# EAGLE design preamp (EAGLE 9.2.1)
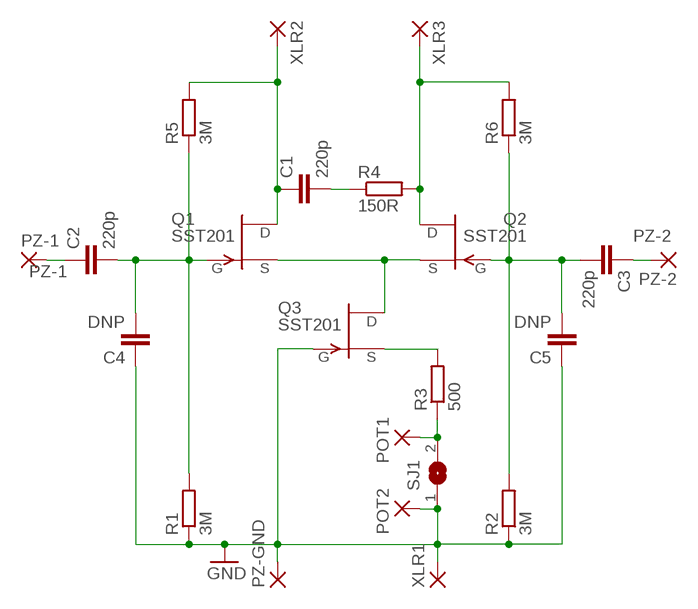
[diagram p0: schematic, sheet 1]

## Parts
C1  220p  C-EUC1206  [C1206]
C2  220p  C-EUC1206  [C1206]
C3  220p  C-EUC1206  [C1206]
C4  DNP  C-EUC1206  [C1206]
C5  DNP  C-EUC1206  [C1206]
POT1  3,17/1,3  [3,17/1,3]
POT2  3,17/1,3  [3,17/1,3]
PZ-1  3,17/1,3  [3,17/1,3]
PZ-2  3,17/1,3  [3,17/1,3]
PZ-GND  3,17/1,3  [3,17/1,3]
Q1  SST201  [SOT23]
Q2  SST201  [SOT23]
Q3  SST201  [SOT23]
R1  3M  R-EU_R1206  [R1206]
R2  3M  R-EU_R1206  [R1206]
R3  500  R-EU_R1206  [R1206]
R4  150R  R-EU_R1206  [R1206]
R5  3M  R-EU_R1206  [R1206]
R6  3M  R-EU_R1206  [R1206]
SJ1  SJ  [SJ]
XLR1  3,17/1,3  [3,17/1,3]
XLR2  3,17/1,3  [3,17/1,3]
XLR3  3,17/1,3  [3,17/1,3]

## Nets
GND: C4.1 C5.1 POT2.1(P) PZ-GND.1(P) Q3.3(G) R1.1 R2.1 SJ1.1 XLR1.1(P)
N$1: Q1.2(S) Q2.2(S) Q3.1(D)
N$2: POT1.1(P) R3.1 SJ1.2
N$3: C2.2 C4.2 Q1.3(G) R1.2 R5.1
N$5: C1.2 R4.1
N$7: C3.2 C5.2 Q2.3(G) R2.2 R6.1
N$9: Q3.2(S) R3.2
PZ-1: C2.1 PZ-1.1(P)
PZ-2: C3.1 PZ-2.1(P)
XLR3: Q2.1(D) R4.2 R6.2 XLR3.1(P)
XLR-2: C1.1 Q1.1(D) R5.2 XLR2.1(P)

## Library data of the parts
C1-C5 = rcl:C-EU: CAPACITOR, European symbol
POT1 POT2 PZ-1 PZ-2 PZ-GND XLR1-XLR3 = wirepad:3,17/1,3: THROUGH-HOLE PAD
Q1-Q3 = transistor-fet:?20*: TEMIC / Siliconix N-Channel JFET Source: JFET-J201_Siliconix_data.pdf
R1-R6 = rcl:R-EU_: RESISTOR, European symbol
SJ1 = jumper:SJ: SMD solder JUMPER

## Board
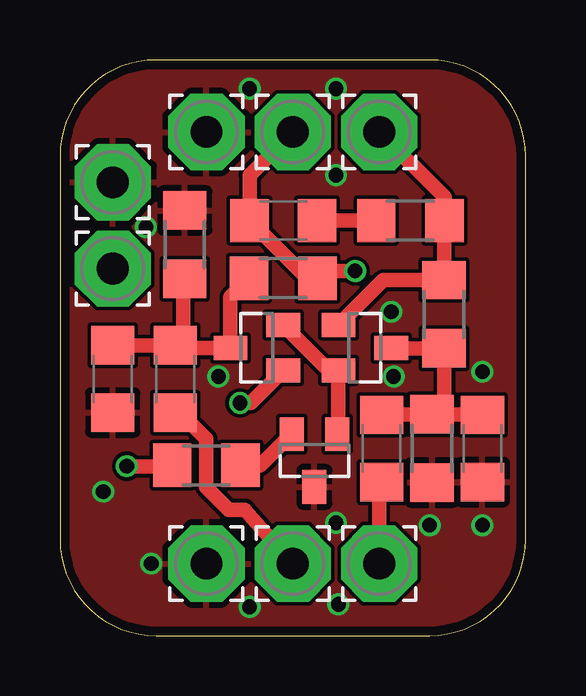
[diagram p1: board, top side]
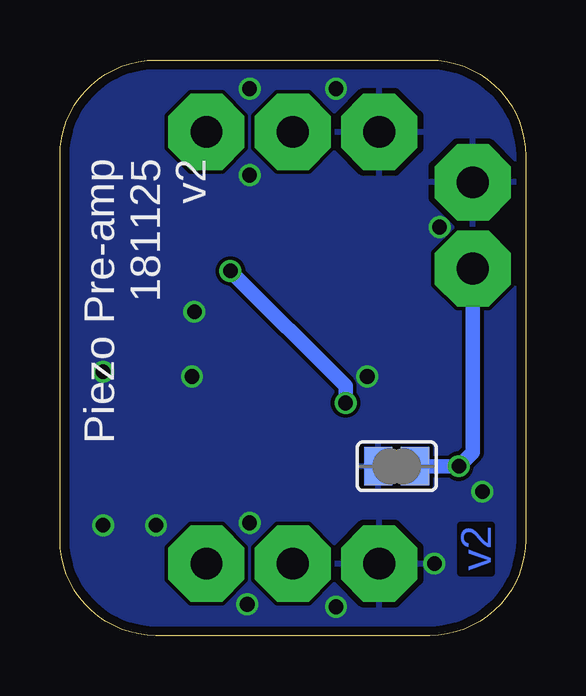
[diagram p2: board, bottom side, seen from below]

Size 19.4 x 24 mm. Coordinates in mm from the lower left corner, seen from the top.
Outline: 0,20 0,4 arc90 4,0 15.4,0 arc90 19.4,4 19.4,20 arc90 15.4,24 4,24 arc90 0,20
Copper layers (1*16): Top 0.035559375mm / dielectric 1.6mm / Bottom 0.035559375mm
Design rules "oshpark-2layer *": minimum track width 6mil, minimum drill 10mil, track to track 6mil, track to pad 6mil, pad to pad 6mil, via to via 6mil, smd to smd 6mil, copper to edge 15mil, drill to drill 6mil, minimum pad ring 5mil, minimum via ring 5mil, stop-mask expansion 2.5mil, vias tented up to drill 24mil, thermal gap 10mil

### Footprints (pad centres in the part's own frame; a part is rotated, then mirrored left to right if it is on the bottom)
C1206 = smd 1.6 x 1.8: 1 -1.4,0; 2 1.4,0
3,17/1,3 = drill 1.321 pad 3.175 octagon: 1 0,0
SOT23 = smd 1 x 1.4: 1 -0.95,-1.1; 2 0.95,-1.1; 3 0,1.1
R1206 = smd 1.6 x 1.803: 1 -1.422,0; 2 1.422,0
SJ = smd 1.168 x 1.6: 1 -0.762,0; 2 0.762,0

### Placement (x,y rotation side)
C1  9.3,17.3 0 top
C2  4.8,10.7 90 top
C3  13.4,7.8 90 top
C4  2.2,10.7 90 top
C5  17.6,7.8 90 top
POT1  2.2,15.3 0 top
POT2  2.2,18.9 0 top
PZ-1  9.7,3 0 top
PZ-2  13.3,3 0 top
PZ-GND  6.1,3 0 top
Q1  8.2,12 90 top
Q2  12.7,12 270 top
Q3  10.6,7.3 180 top
R1  5.2,16.3 270 top
R2  15.5,7.8 90 top
R3  6.1,7.1 0 top
R4  14.6,17.3 0 top
R5  9.3,14.9 0 top
R6  16,13.4 90 top
SJ1  5.37,7.06 0 bottom
XLR1  6.1,21 0 top
XLR2  9.7,21 0 top
XLR3  13.3,21 0 top

### Tracks (layer width: path | path; a pad name or v marks a point on that pad's centre or on a via)
GND  (via drill 0.61)
  other vias: 11.5,4.7 15.4,4.6 11.5,19.2 13.8,13.5 7.9,1.2 11.6,1.3 7.9,22.8 11.5,22.8 3.58,17.03 1.8,6 6.6,10.8 13.9,10.8 3.8,3 17.6,11 17.6,4.6
  pour Top: 15.4,0 4,0 arc-90 0,4 0,20 arc-90 4,24 15.4,24 arc-90 19.4,20 19.4,4 arc-90
  pour Bottom: 0,4 0,20 arc-90 4,24 15.4,24 arc-90 19.4,20 19.4,4 arc-90 15.4,0 4,0 arc-90
N$1
  Top 0.607: Q1.2 11.2,11.05 Q2.2 11.6,8.45 Q3.1
N$2  (via drill 0.61)
  Top 0.61: v2.78,7.06 4.64,7.06 R3.1
  Bottom 0.61: POT1.1 2.2,7.64 v2.78,7.06 SJ1.2
N$3
  Top 0.607: R1.2 arc-90 5.14,14.82 5.14,12.54 C2.2 5.3,11.6 | 5.3,12 Q1.3 7.1,14.12 R5.1
  Top 0.61: C4.2 5.3,12.1 5.3,12 5.3,11.6
N$5
  Top 0.607: R4.1 C1.2
N$7
  Top 0.607: C3.2 13.4,9.22 R2.2 16,9.72 R6.1 13.82,11.98 Q2.3
  Top 0.61: R2.2 17.58,9.22 C5.2
N$9
  Top 0.607: Q3.2 8.35,7.1 R3.2
PZ-1
  Top 0.607: PZ-1.1 7.7,5.24 7.03,5.24 6.1,6.18
  Top 0.61: 6.1,6.18 6.1,8.2 5.14,9.16 arc45 C2.1
PZ-2
  Top 0.61: PZ-2.1 13.3,6.3 C3.1
XLR3
  Top 0.607: R4.2 16,17.28 R6.2 13.47,14.82 Q2.1
  Top 0.61: XLR3.1 16.02,18.28 R4.2
XLR-2  (via drill 0.61)
  Top 0.607: 11.03,15.2 v12.3,15.2 | Q1.1 7.95,9.7 v7.5,9.7
  Top 0.61: XLR2.1 7.9,19.2 C1.1 10.3,14.9 R5.2 10.73,14.9 11.03,15.2
  Bottom 0.607: v7.5,9.7 7.5,10.4 v12.3,15.2

### Text on the board
Bottom: v2
bPlace: Piezo Pre-amp / 181125 / v2